# Altium project Main Project.PrjPcb
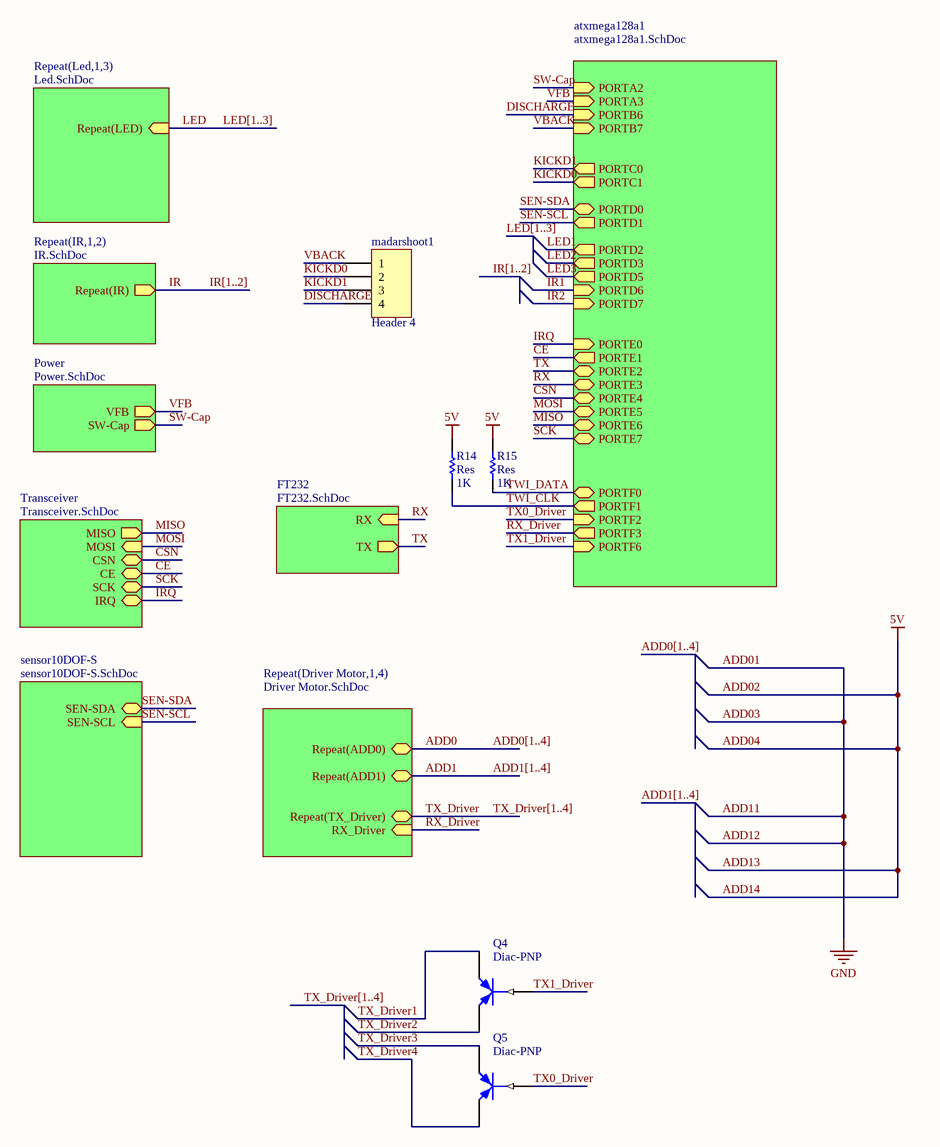
[diagram p0: Main Sheet.SchDoc]
9 sheets, 148 parts. Net scope: hierarchical (ports join the sheet entries above them; power ports are global).
Board file: PCB1.PcbDoc
Sheets:
  Main Sheet.SchDoc
    Led1 = Led.SchDoc
    Led2 = Led.SchDoc
    Led3 = Led.SchDoc
    IR1 = IR.SchDoc
    IR2 = IR.SchDoc
    atxmega128a1 = atxmega128a1.SchDoc
    Power = Power.SchDoc
    Transceiver = Transceiver.SchDoc
    Driver Motor1 = Driver Motor.SchDoc
    Driver Motor2 = Driver Motor.SchDoc
    Driver Motor3 = Driver Motor.SchDoc
    Driver Motor4 = Driver Motor.SchDoc
    FT232 = FT232.SchDoc
    sensor10DOF-S = sensor10DOF-S.SchDoc

## Sheet Main Sheet.SchDoc
size A3

### Parts
madarshoot1  Header 4  [sucket-smd-4pin]
Q4  Diac-PNP  [Diode-comcathod]
Q5  Diac-PNP  [Diode-comcathod]
R14  Res  value 1K  [2012[0805]]
R15  Res  value 1K  [2012[0805]]

### Sub-sheets
atxmega128a1 = atxmega128a1.SchDoc: PORTD5 (out), PORTD6 (in), PORTD7 (in), PORTD2 (out), PORTA3 (in), PORTE0 (in), PORTE1 (out), PORTE2, PORTB6 (in), PORTB7 (in), PORTC0 (out), PORTC1 (out), PORTF0 (bidir), PORTF1 (out), PORTE3, PORTE4, PORTE5, PORTE6, PORTE7, PORTA2 (in), PORTD3 (out), PORTD0, PORTD1 (out), PORTF2 (in), PORTF3 (out), PORTF6 (in)
FT232 = FT232.SchDoc: RX (in), TX (out)
Power = Power.SchDoc: VFB (out), SW-Cap (out)
Repeat(Driver Motor,1,4) = Driver Motor.SchDoc: Repeat(ADD0), Repeat(ADD1), Repeat(TX_Driver), RX_Driver (in)
Repeat(IR,1,2) = IR.SchDoc: Repeat(IR) (out)
Repeat(Led,1,3) = Led.SchDoc: Repeat(LED) (in)
sensor10DOF-S = sensor10DOF-S.SchDoc: SEN-SDA, SEN-SCL (in)
Transceiver = Transceiver.SchDoc: MISO (out), MOSI (in), CSN, CE, SCK, IRQ

### Nets
5V: R14.2 R15.2  [also labelled ADD02, ADD04, ADD13, ADD14]
ADD0: sheet Repeat(Driver Motor,1,4)/Repeat(ADD0)
ADD1: sheet Repeat(Driver Motor,1,4)/Repeat(ADD1)
CE: sheet atxmega128a1/PORTE1, sheet Transceiver/CE
CSN: sheet atxmega128a1/PORTE4, sheet Transceiver/CSN
DISCHARGE: madarshoot1.4 ; sheet atxmega128a1/PORTB6
IR: sheet Repeat(IR,1,2)/Repeat(IR)
IRQ: sheet atxmega128a1/PORTE0, sheet Transceiver/IRQ
KICKD0: madarshoot1.2 ; sheet atxmega128a1/PORTC1
KICKD1: madarshoot1.3 ; sheet atxmega128a1/PORTC0
LED: sheet Repeat(Led,1,3)/Repeat(LED)
MISO: sheet atxmega128a1/PORTE6, sheet Transceiver/MISO
MOSI: sheet atxmega128a1/PORTE5, sheet Transceiver/MOSI
RX: sheet atxmega128a1/PORTE3, sheet FT232/RX  [project net PORTE3]
RX_Driver: sheet atxmega128a1/PORTF3, sheet Repeat(Driver Motor,1,4)/RX_Driver  [project net PORTF3]
SCK: sheet atxmega128a1/PORTE7, sheet Transceiver/SCK  [project net PORTE7]
SEN-SCL: sheet atxmega128a1/PORTD1, sheet sensor10DOF-S/SEN-SCL  [project net PORTD1]
SEN-SDA: sheet atxmega128a1/PORTD0, sheet sensor10DOF-S/SEN-SDA  [project net PORTD0]
SW-Cap: sheet atxmega128a1/PORTA2, sheet Power/SW-Cap  [project net PORTA2]
TWI_CLK: R14.1 ; sheet atxmega128a1/PORTF1  [project net PORTF1]
TWI_DATA: R15.1 ; sheet atxmega128a1/PORTF0  [project net PORTF0]
TX: sheet atxmega128a1/PORTE2, sheet FT232/TX  [project net PORTE2]
TX0_Driver: Q5.1(B) ; sheet atxmega128a1/PORTF2  [project net PORTF2]
TX1_Driver: Q4.1(B) ; sheet atxmega128a1/PORTF6  [project net PORTF6]
TX_Driver: sheet Repeat(Driver Motor,1,4)/Repeat(TX_Driver)
TX_Driver1: Q4.3(C)  [project net TX_Driver]
TX_Driver2: Q4.2(E)  [project net TX_Driver]
TX_Driver3: Q5.3(C)  [project net TX_Driver]
TX_Driver4: Q5.2(E)  [project net TX_Driver]
VBACK: madarshoot1.1 ; sheet atxmega128a1/PORTB7  [project net PORTB7]
VFB: sheet atxmega128a1/PORTA3, sheet Power/VFB  [project net PORTA3]

### Buses and harness runs
bus ADD0[1..4]
bus ADD1[1..4]
bus IR[1..2]
bus LED[1..3]
bus TX_Driver[1..4]

### Notes on the sheet
- Title
- Size:
- Date:
- A3
- Number:
- Time:
- Revision:
- Sheet
- of
- File:

### Library data of the parts
madarshoot1 = Header 4: Header, 4-Pin; LatestRevisionDate: 17-Jul-2002; LatestRevisionNote: Re-released for DXP Platform.; Publisher: Altium Limited
Q4 Q5 = Diac-PNP: DIAC; Published: 24-Mar-1999; LatestRevisionDate: 29-May-2009; LatestRevisionNote: IPC-7351 Footprint Added.; PackageVersion: Jul-2004; PackageReference: SOT89; Publisher: Altium Limited; PackageDescription: 3-Pin SOT-89 Package 1.5 mm Pitch, 4.1 mm Lead Span; Code_JEDEC: TO-243-AA
R14 R15 = Res: Semiconductor Resistor; Published: 8-Jun-2000; LatestRevisionDate: 17-Jul-2002; LatestRevisionNote: Re-released for DXP Platform.; PackageReference: AXIAL-0.5; Publisher: Altium Limited

## Sheet Led.SchDoc
size A
Used 3 times, as channels Led1, Led2, Led3. Parts and nets are listed once, with the designators drawn on the sheet.
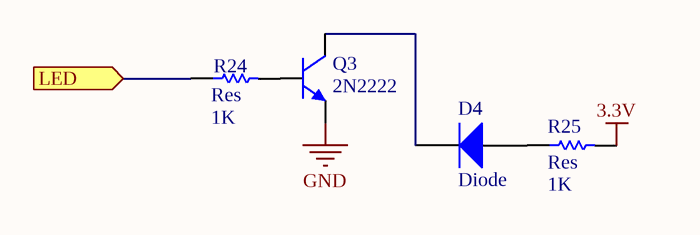
[diagram p1: Led.SchDoc]

### Parts
D4  Diode  [2012[0805]]
Q3  2N2222  [SOT-23]
R24  Res  value 1K  [2012[0805]]
R25  Res  value 1K  [2012[0805]]

### Ports
LED (in)

### Nets
3.3V: R25.2
GND: Q3.3(E)
LED: R24.1 ; port LED
NetD4_1: D4.1(A) R25.1
NetD4_2: D4.2(K) Q3.1(C)
NetQ3_2: Q3.2(B) R24.2

### Channels
Led1: designators end in _Led1; ports LED=LED1
Led2: designators end in _Led2; ports LED=LED2
Led3: designators end in _Led3; ports LED=LED3

### Library data of the parts
D4 = Diode: 1 Amp General Purpose Rectifier; Revision 1: 11-Jul-2000: SIM Model Added.; Revision 2: 17-Jul-2002: Re-released for DXP Platform.; Package Information: Latest Revision: Aug-1999; Code - JEDEC: DO-204-AL; Published: 8-Jun-2000; Datasheet: Latest Revision: 1998; Package Reference: DO-41; Publisher: Altium Limited
Q3 = 2N2222: NPN Bipolar Transistor; Published: 8-Jun-2000; LatestRevisionDate: 17-Jul-2002; LatestRevisionNote: Re-released for DXP Platform.; PackageReference: TO-226; Publisher: Altium Limited; Code_JEDEC: TO-226-AA
R24 R25 = Res: Semiconductor Resistor; Published: 8-Jun-2000; LatestRevisionDate: 17-Jul-2002; LatestRevisionNote: Re-released for DXP Platform.; PackageReference: AXIAL-0.5; Publisher: Altium Limited

## Sheet IR.SchDoc
size A
Used 2 times, as channels IR1, IR2. Parts and nets are listed once, with the designators drawn on the sheet.
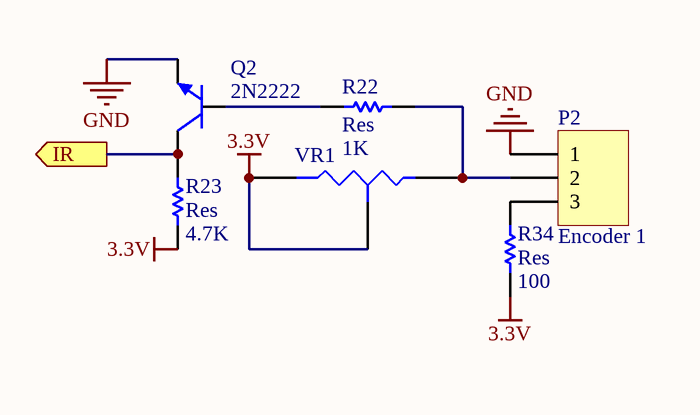
[diagram p2: IR.SchDoc]

### Parts
P2  Encoder 1  [HDR1X3]
Q2  2N2222  [SOT-23]
R22  Res  value 1K  [2012[0805]]
R23  Res  value 4.7K  [2012[0805]]
R34  Res  value 100  [2012[0805]]
VR1  Res Tap  [MULTITURN]  (value not drawn)

### Ports
IR (out)

### Nets
3.3V: R23.1 R34.1 VR1.2(B) VR1.3(TAP)
GND: P2.1 Q2.3(E)
IR: Q2.1(C) R23.2 ; port IR
NetP2_2: P2.2 R22.2 VR1.1(A)
NetP2_3: P2.3 R34.2
NetQ2_2: Q2.2(B) R22.1

### Channels
IR1: designators end in _IR1; ports IR=IR1
IR2: designators end in _IR2; ports IR=IR2

### Library data of the parts
P2 = Header 3: Header, 3-Pin; LatestRevisionDate: 17-Jul-2002; LatestRevisionNote: Re-released for DXP Platform.; Publisher: Altium Limited
Q2 = 2N2222: NPN Bipolar Transistor; Published: 8-Jun-2000; LatestRevisionDate: 17-Jul-2002; LatestRevisionNote: Re-released for DXP Platform.; PackageReference: TO-226; Publisher: Altium Limited; Code_JEDEC: TO-226-AA
R22 R23 R34 = Res: Semiconductor Resistor; Published: 8-Jun-2000; LatestRevisionDate: 17-Jul-2002; LatestRevisionNote: Re-released for DXP Platform.; PackageReference: AXIAL-0.5; Publisher: Altium Limited
VR1 = Res Tap: Tapped Resistor; Sim Note: Enter the Resistance value and the set point into parameter fields.; Set Position: 0.5; Published: 24-Mar-1999; LatestRevisionDate: 17-Jul-2002; LatestRevisionNote: Re-released for DXP Platform.; PackageReference: VR3; Publisher: Altium Limited

## Sheet atxmega128a1.SchDoc
size A3
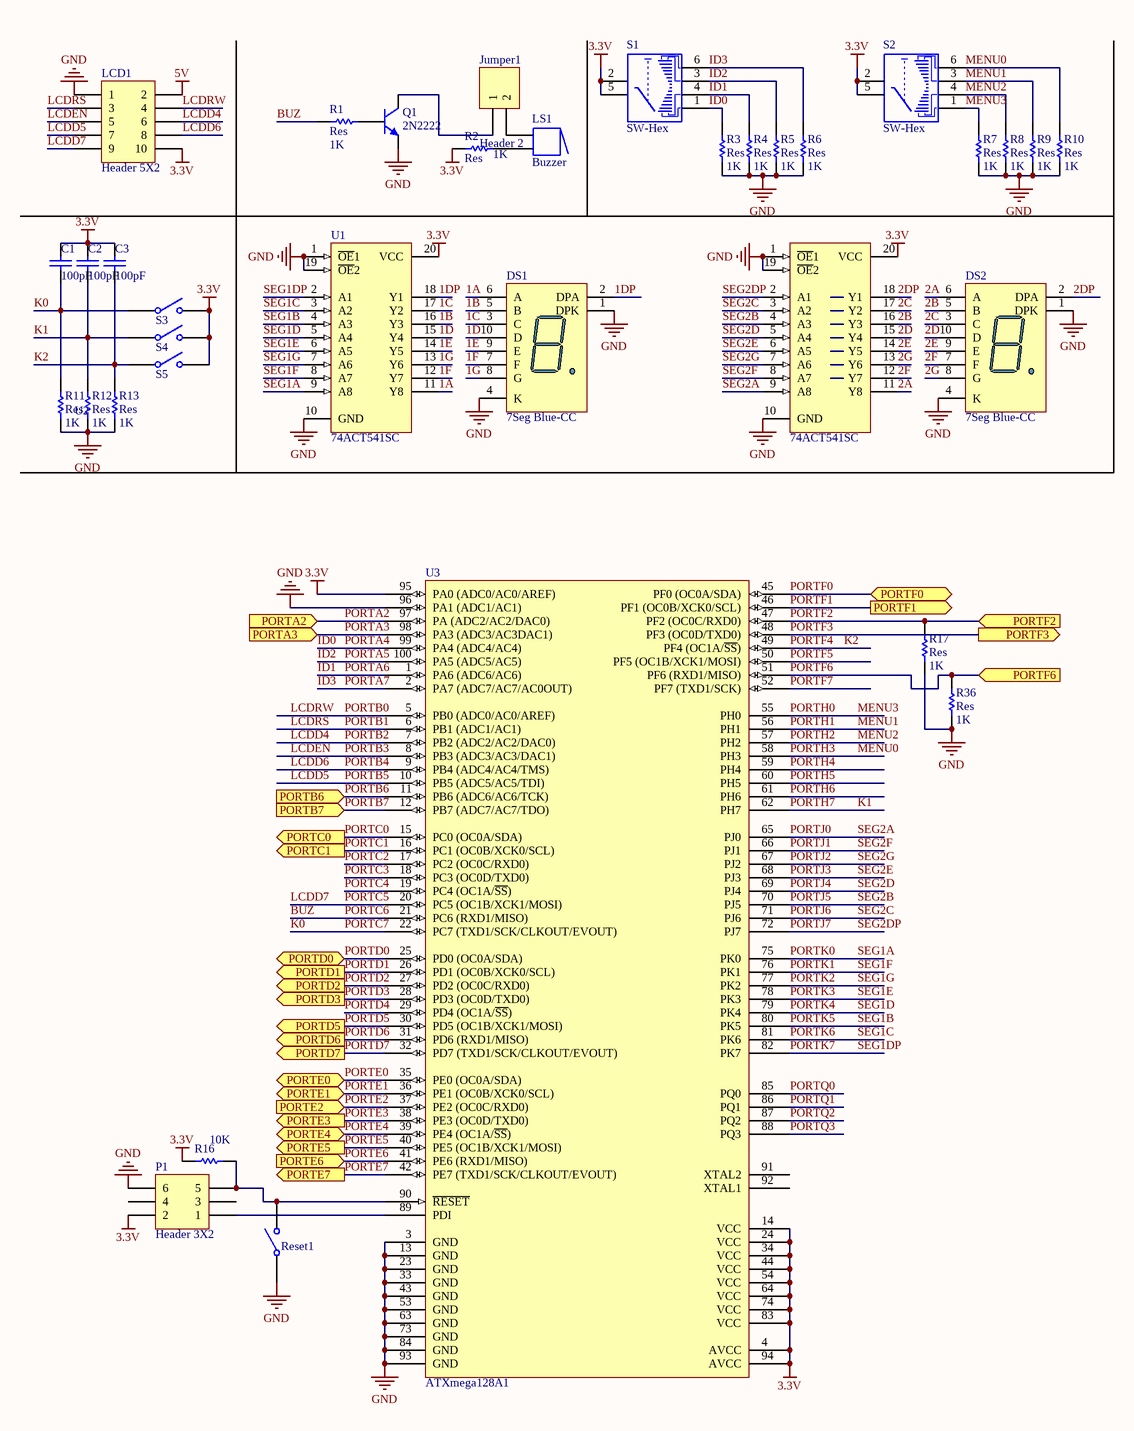
[diagram p3: atxmega128a1.SchDoc]

### Parts
C1  value 100pF  [2012[0805]]  (hidden comment: Cap_UP)
C2  value 100pF  [2012[0805]]  (hidden comment: Cap_UP)
C3  value 100pF  [2012[0805]]  (hidden comment: Cap_UP)
DS1  7Seg Blue-CC  [7Segment Small]
DS2  7Seg Blue-CC  [7Segment Small]
Jumper1  Header 2  [HDR1X2]
LCD1  Header 5X2  [HDRBOX2X5]
LS1  Buzzer  [BUZZER]
P1  Header 3X2  [HDRBOX2X3]
Q1  2N2222  [SOT-23]
R1  Res  value 1K  [2012[0805]]
R2  Res  value 1K  [2012[0805]]
R3  Res  value 1K  [2012[0805]]
R4  Res  value 1K  [2012[0805]]
R5  Res  value 1K  [2012[0805]]
R6  Res  value 1K  [2012[0805]]
R7  Res  value 1K  [2012[0805]]
R8  Res  value 1K  [2012[0805]]
R9  Res  value 1K  [2012[0805]]
R10  Res  value 1K  [2012[0805]]
R11  Res  value 1K  [2012[0805]]
R12  Res  value 1K  [2012[0805]]
R13  Res  value 1K  [2012[0805]]
R16  10K  [2012[0805]]
R17  Res  value 1K  [2012[0805]]
R36  Res  value 1K  [2012[0805]]
Reset1  SW-SPST  [PUSH-BUT]  (value not drawn)
S1  SW-Hex  [SW-HEX]
S2  SW-Hex  [SW-HEX]
S3  SW-SPST  [PUSH-BUT]  (value not drawn)
S4  SW-SPST  [PUSH-BUT]  (value not drawn)
S5  SW-SPST  [PUSH-BUT]  (value not drawn)
U1  74ACT541SC  [M20B_M]
U2  74ACT541SC  [M20B_M]
U3  ATXmega128A1  [100A_N]

### Ports
PORTA2 (in), PORTA3 (in), PORTB6 (in), PORTB7 (in), PORTC0 (out), PORTC1 (out), PORTD0, PORTD1 (out), PORTD2 (out), PORTD3 (out), PORTD5 (out), PORTD6 (out), PORTD7 (out), PORTE0, PORTE1, PORTE2 (in), PORTE3 (out), PORTE4, PORTE5 (out), PORTE6 (in), PORTE7 (out), PORTF0, PORTF1 (out), PORTF2 (in), PORTF3 (out), PORTF6 (in)

### Nets
3.3V: C1.2 C2.2 C3.2 LCD1.10 P1.2 R2.1 R16.1 S1.2 S1.5 S2.2 S2.5 S3.2(NO) S4.2(NO) S5.2(NO) U1.20(VCC) U2.20(VCC) U3.4(AVCC) U3.14(VCC) U3.24(VCC) U3.34(VCC) U3.44(VCC) U3.54(VCC) U3.64(VCC) U3.74(VCC) U3.83(VCC) U3.94(AVCC) U3.95(PA0_(ADC0/AC0/AREF))
5V: LCD1.2
GND: DS1.1(DPK) DS1.4(K) DS2.1(DPK) DS2.4(K) LCD1.1 P1.6 Q1.3(E) R3.1 R4.1 R5.1 R6.1 R7.1 R8.1 R9.1 R10.1 R11.2 R12.2 R13.2 R17.1 R36.1 Reset1.1(COMMON) U1.1(~{OE}1) U1.10(GND) U1.19(~{OE}2) U2.1(~{OE}1) U2.10(GND) U2.19(~{OE}2) U3.3(GND) U3.13(GND) U3.23(GND) U3.33(GND) U3.43(GND) U3.53(GND) U3.63(GND) U3.73(GND) U3.84(GND) U3.93(GND) U3.96(PA1_(ADC1/AC1))  [project net ADD0]
1A: DS1.6(A) U1.11(Y8)
1B: DS1.5(B) U1.16(Y3)
1C: DS1.3(C) U1.17(Y2)
1D: DS1.10(D) U1.15(Y4)
1DP: DS1.2(DPA) U1.18(Y1)
1E: DS1.9(E) U1.14(Y5)
1F: DS1.7(F) U1.12(Y7)
1G: DS1.8(G) U1.13(Y6)
2A: DS2.6(A) U2.11(Y8)
2B: DS2.5(B) U2.16(Y3)
2C: DS2.3(C) U2.17(Y2)
2D: DS2.10(D) U2.15(Y4)
2DP: DS2.2(DPA) U2.18(Y1)
2E: DS2.9(E) U2.14(Y5)
2F: DS2.7(F) U2.12(Y7)
2G: DS2.8(G) U2.13(Y6)
BUZ: R1.1 U3.21(PC6_(RXD1/MISO))  [also labelled PORTC6]
ID0: R3.2 S1.1 U3.99(PA4_(ADC4/AC4))  [also labelled PORTA4]
ID1: R4.2 S1.4 U3.1(PA6_(ADC6/AC6))  [also labelled PORTA6]
ID2: R5.2 S1.3 U3.100(PA5_(ADC5/AC5))  [also labelled PORTA5]
ID3: R6.2 S1.6 U3.2(PA7_(ADC7/AC7/AC0OUT))  [also labelled PORTA7]
K0: C1.1 R11.1 S3.1(COMMON) U3.22(PC7_(TXD1/SCK/CLKOUT/EVOUT))  [also labelled PORTC7]
K1: C2.1 R12.1 S4.1(COMMON) U3.62(PH7)  [also labelled PORTH7]
K2: C3.1 R13.1 S5.1(COMMON) U3.49(PF4_(OC1A/~{SS}))  [also labelled PORTF4]
LCDD4: LCD1.6 U3.7(PB2_(ADC2/AC2/DAC0))  [also labelled PORTB2]
LCDD5: LCD1.7 U3.10(PB5_(ADC5/AC5/TDI))  [also labelled PORTB5]
LCDD6: LCD1.8 U3.9(PB4_(ADC4/AC4/TMS))  [also labelled PORTB4]
LCDD7: LCD1.9 U3.20(PC5_(OC1B/XCK1/MOSI))  [also labelled PORTC5]
LCDEN: LCD1.5 U3.8(PB3_(ADC3/AC3/DAC1))  [also labelled PORTB3]
LCDRS: LCD1.3 U3.6(PB1_(ADC1/AC1))  [also labelled PORTB1]
LCDRW: LCD1.4 U3.5(PB0_(ADC0/AC0/AREF))  [also labelled PORTB0]
MENU0: R10.2 S2.6 U3.58(PH3)  [also labelled PORTH3]
MENU1: R9.2 S2.3 U3.56(PH1)  [also labelled PORTH1]
MENU2: R8.2 S2.4 U3.57(PH2)  [also labelled PORTH2]
MENU3: R7.2 S2.1 U3.55(PH0)  [also labelled PORTH0]
PORTA2: U3.97(PA_(ADC2/AC2/DAC0)) ; port PORTA2
PORTA3: U3.98(PA3_(ADC3/AC3DAC1)) ; port PORTA3
PORTB6: U3.11(PB6_(ADC6/AC6/TCK)) ; port PORTB6  [project net DISCHARGE]
PORTB7: U3.12(PB7_(ADC7/AC7/TDO)) ; port PORTB7
PORTC0: U3.15(PC0_(OC0A/SDA)) ; port PORTC0  [project net KICKD1]
PORTC1: U3.16(PC1_(OC0B/XCK0/SCL)) ; port PORTC1  [project net KICKD0]
PORTC2: U3.17(PC2_(OC0C/RXD0))
PORTC3: U3.18(PC3_(OC0D/TXD0))
PORTC4: U3.19(PC4_(OC1A/~{SS}))
PORTD0: U3.25(PD0_(OC0A/SDA)) ; port PORTD0
PORTD1: U3.26(PD1_(OC0B/XCK0/SCL)) ; port PORTD1
PORTD2: U3.27(PD2_(OC0C/RXD0)) ; port PORTD2  [project net LED1]
PORTD3: U3.28(PD3_(OC0D/TXD0)) ; port PORTD3  [project net LED2]
PORTD4: U3.29(PD4_(OC1A/~{SS}))
PORTD5: U3.30(PD5_(OC1B/XCK1/MOSI)) ; port PORTD5  [project net LED3]
PORTD6: U3.31(PD6_(RXD1/MISO)) ; port PORTD6  [project net IR1]
PORTD7: U3.32(PD7_(TXD1/SCK/CLKOUT/EVOUT)) ; port PORTD7  [project net IR2]
PORTE0: U3.35(PE0_(OC0A/SDA)) ; port PORTE0  [project net IRQ]
PORTE1: U3.36(PE1_(OC0B/XCK0/SCL)) ; port PORTE1  [project net CE]
PORTE2: U3.37(PE2_(OC0C/RXD0)) ; port PORTE2
PORTE3: U3.38(PE3_(OC0D/TXD0)) ; port PORTE3
PORTE4: U3.39(PE4_(OC1A/~{SS})) ; port PORTE4  [project net CSN]
PORTE5: U3.40(PE5_(OC1B/XCK1/MOSI)) ; port PORTE5  [project net MOSI]
PORTE6: U3.41(PE6_(RXD1/MISO)) ; port PORTE6  [project net MISO]
PORTE7: U3.42(PE7_(TXD1/SCK/CLKOUT/EVOUT)) ; port PORTE7
PORTF0: U3.45(PF0_(OC0A/SDA)) ; port PORTF0
PORTF1: U3.46(PF1_(OC0B/XCK0/SCL)) ; port PORTF1
PORTF2: R17.2 U3.47(PF2_(OC0C/RXD0)) ; port PORTF2
PORTF3: U3.48(PF3_(OC0D/TXD0)) ; port PORTF3
PORTF5: U3.50(PF5_(OC1B/XCK1/MOSI))
PORTF6: R36.2 U3.51(PF6_(RXD1/MISO)) ; port PORTF6
PORTF7: U3.52(PF7_(TXD1/SCK))
PORTH4: U3.59(PH4)
PORTH5: U3.60(PH5)
PORTH6: U3.61(PH6)
PORTJ0: U2.9(A8) U3.65(PJ0)  [also labelled SEG2A]
PORTJ1: U2.8(A7) U3.66(PJ1)  [also labelled SEG2F]
PORTJ2: U2.7(A6) U3.67(PJ2)  [also labelled SEG2G]
PORTJ3: U2.6(A5) U3.68(PJ3)  [also labelled SEG2E]
PORTJ4: U2.5(A4) U3.69(PJ4)  [also labelled SEG2D]
PORTJ5: U2.4(A3) U3.70(PJ5)  [also labelled SEG2B]
PORTJ6: U2.3(A2) U3.71(PJ6)  [also labelled SEG2C]
PORTJ7: U2.2(A1) U3.72(PJ7)  [also labelled SEG2DP]
PORTK0: U1.9(A8) U3.75(PK0)  [also labelled SEG1A]
PORTK1: U1.8(A7) U3.76(PK1)  [also labelled SEG1F]
PORTK2: U1.7(A6) U3.77(PK2)  [also labelled SEG1G]
PORTK3: U1.6(A5) U3.78(PK3)  [also labelled SEG1E]
PORTK4: U1.5(A4) U3.79(PK4)  [also labelled SEG1D]
PORTK5: U1.4(A3) U3.80(PK5)  [also labelled SEG1B]
PORTK6: U1.3(A2) U3.81(PK6)  [also labelled SEG1C]
PORTK7: U1.2(A1) U3.82(PK7)  [also labelled SEG1DP]
PORTQ0: U3.85(PQ0)
PORTQ1: U3.86(PQ1)
PORTQ2: U3.87(PQ2)
PORTQ3: U3.88(PQ3)
NetJumper1_1: Jumper1.1 Q1.1(C)
NetJumper1_2: Jumper1.2 LS1.1
NetLS1_2: LS1.2 R2.2
NetP1_1: P1.1 U3.89(PDI)
NetP1_5: P1.5 R16.2 Reset1.2(NO) U3.90(~{RESET})
NetQ1_2: Q1.2(B) R1.2

Not connected (* = marked no-connect by the designer): P1 3 4; U3 91(XTAL2) 92(XTAL1)

### Library data of the parts
C1-C3 = Cap_UP: Capacitor; Published: 8-Jun-2000; LatestRevisionDate: 17-Jul-2002; LatestRevisionNote: Re-released for DXP Platform.; PackageReference: RAD-0.3; Publisher: Altium Limited
DS1 DS2 = 7Seg Blue-CC_1: 14.2 mm General Purpose Blue 7-Segment Display: CC, RH DP, Gray Surface; MinimumIntensity: 2020 ucd; Note: IF = 10 mA; Published: 8-Jun-2000; LatestRevisionDate: 17-Dec-2003; LatestRevisionNote: Schematic revised, PCB Footprint replaced.; DatasheetDocument: 24-Sep-2002; PackageDocument: 24-Sep-2002; PackageReference: H; Publisher: Altium Limited; Colour: Blue; ComponentLink1Description: Manufacturer Link; ComponentLink1URL: http://www.agilent.com/
Jumper1 = Header 2: Header, 2-Pin; LatestRevisionDate: 17-Jul-2002; LatestRevisionNote: Re-released for DXP Platform.; Publisher: Altium Limited
LCD1 = Header 5X2: Header, 5-Pin, Dual row; LatestRevisionDate: 17-Jul-2002; LatestRevisionNote: Re-released for DXP Platform.; Publisher: Altium Limited
LS1 = Buzzer: Magnetic Transducer Buzzer; Published: 24-Mar-1999; LatestRevisionDate: 17-Dec-2003; LatestRevisionNote: Schematic revised, PCB Footprint replaced.; DatasheetDocument: 17-Dec-2003; PackageReference: ABSM-1574; Publisher: Altium Limited; ComponentLink1Description: Manufacturer Link; ComponentLink1URL: http://www.megastar.com/linecard/buzzmode/index.php
P1 = Header 3X2: Header, 3-Pin, Dual row; LatestRevisionDate: 17-Jul-2002; LatestRevisionNote: Re-released for DXP Platform.; Publisher: Altium Limited
Q1 = 2N2222: NPN Bipolar Transistor; Published: 8-Jun-2000; LatestRevisionDate: 17-Jul-2002; LatestRevisionNote: Re-released for DXP Platform.; PackageReference: TO-226; Publisher: Altium Limited; Code_JEDEC: TO-226-AA
R1-R13 R16 R17 R36 = Res: Semiconductor Resistor; Published: 8-Jun-2000; LatestRevisionDate: 17-Jul-2002; LatestRevisionNote: Re-released for DXP Platform.; PackageReference: AXIAL-0.5; Publisher: Altium Limited
Reset1 S3-S5 = SW-SPST: Single-Pole, Single-Throw Switch; Published: 24-Mar-1999; Revision: July-2002: Re-released for DXP Platform.; Publisher: Altium Limited
U1 U2 = 74ACT541SC: Octal Buffer/Line Driver with 3-State Output; Published: 17-Jul-2002; LatestRevisionDate: 13-Apr-2006; LatestRevisionNote: IPC-7351 Footprint Added.; DatasheetVersion: Oct-1999; PackageVersion: 2000; PackageReference: M20B; Publisher: Altium Limited; PackageDescription: 20-Pin Small Outline Integrated Circuit 1.27 mm Pitch; Code_JEDEC: MS-013-AC; Code_IPC: SOIC127P1030-20; ComponentLink1Description: Manufacturer Link; ComponentLink1URL: http://www.fairchildsemi.com/; ComponentLink2Description: Datasheet; ComponentLink2URL: http://www.fairchildsemi.com/ds/74%2F74AC541.pdf
S1 S2 = SW-Hex: Published: 24-Mar-1999; LatestRevisionDate: 17-Jul-2002; LatestRevisionNote: Re-released for DXP Platform.; PackageReference: DIP-8; Publisher: Altium Limited

## Sheet Power.SchDoc
size A
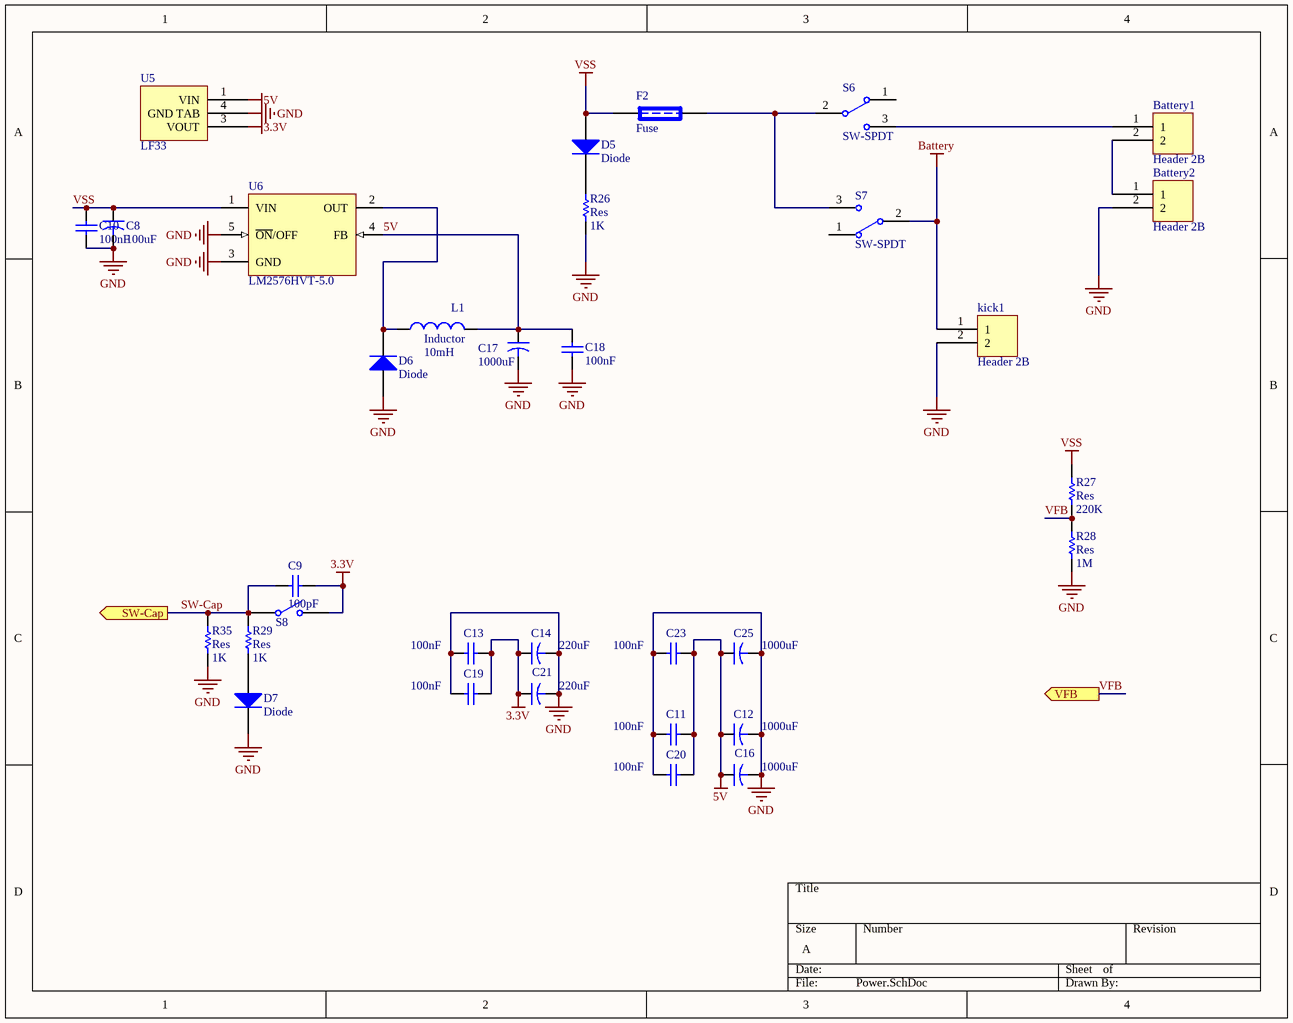
[diagram p4: Power.SchDoc]

### Parts
Battery1  Header 2B  [BHDR1X2]
Battery2  Header 2B  [BHDR1X2]
C8  value 100uF  [Cap1000u-16]  (hidden comment: Cap_El)
C9  value 100pF  [2012[0805]]  (hidden comment: Cap_UP)
C10  value 100nF  [2012[0805]]  (hidden comment: Cap_UP)
C11  value 100nF  [2012[0805]]  (hidden comment: Cap_UP)
C12  value 1000uF  [7343]  (hidden comment: Cap_El)
C13  value 100nF  [2012[0805]]  (hidden comment: Cap_UP)
C14  value 220uF  [7343]  (hidden comment: Cap_El)
C16  value 1000uF  [7343]  (hidden comment: Cap_El)
C17  value 1000uF  [7343]  (hidden comment: Cap_El)
C18  value 100nF  [2012[0805]]  (hidden comment: Cap_UP)
C19  value 100nF  [2012[0805]]  (hidden comment: Cap_UP)
C20  value 100nF  [2012[0805]]  (hidden comment: Cap_UP)
C21  value 220uF  [7343]  (hidden comment: Cap_El)
C23  value 100nF  [2012[0805]]  (hidden comment: Cap_UP)
C25  value 1000uF  [7343]  (hidden comment: Cap_El)
D5  Diode  [2012[0805]]
D6  Diode  [US1M]
D7  Diode  [2012[0805]]
F2  Fuse  [fuse kh]
kick1  Header 2B  [BHDR1X2]
L1  Inductor  value 10mH  [inductor]
R26  Res  value 1K  [2012[0805]]
R27  Res  value 220K  [2012[0805]]
R28  Res  value 1M  [2012[0805]]
R29  Res  value 1K  [2012[0805]]
R35  Res  value 1K  [2012[0805]]
S6  SW-SPDT  [KEYKHRAB]
S7  SW-SPDT  [KEYKHRAB]
S8  SW-SPST  [push button B]  (value not drawn)
U5  LF33  [D-PACK]
U6  LM2576HVT-5.0  [T05A]

### Ports
SW-Cap (out), VFB (out)

### Nets
3.3V: C9.2 C13.2 C14.1 C19.2 C21.1 S8.2(NO) U5.3(VOUT)
5V: C11.2 C12.1 C16.1 C17.1 C18.2 C20.2 C23.2 C25.1 L1.2 U5.1(VIN) U6.4(FB)
Battery: kick1.1 S7.2
GND: Battery2.2 C8.2 C10.1 C11.1 C12.2 C13.1 C14.2 C16.2 C17.2 C18.1 C19.1 C20.1 C21.2 C23.1 C25.2 D6.1(A) D7.2(K) kick1.2 R26.1 R28.1 R35.1 U5.4(GND_TAB) U6.3(GND) U6.5(~{ON}/OFF)  [project net ADD0]
VSS: C8.1 C10.2 D5.1(A) F2.1 R27.2 U6.1(VIN)
SW-Cap: C9.1 R29.2 R35.2 S8.1(COMMON) ; port SW-Cap  [project net PORTA2]
VFB: R27.1 R28.2 ; port VFB  [project net PORTA3]
NetBattery1_1: Battery1.1 S6.3
NetBattery1_2: Battery1.2 Battery2.1
NetD5_2: D5.2(K) R26.2
NetD6_2: D6.2(K) L1.1 U6.2(OUT)
NetD7_1: D7.1(A) R29.1
NetF2_2: F2.2 S6.2 S7.3

Not connected (* = marked no-connect by the designer): S6 1(3); S7 1(3)

### Library data of the parts
C8 C12 C14 C16 C17 C21 C25 = Cap_El: Capacitor; Published: 23-Sep-2002; PackageReference: CAPR5-4X5; Publisher: Altium Limited
C9-C11 C13 C18-C20 C23 = Cap_UP: Capacitor; Published: 8-Jun-2000; LatestRevisionDate: 17-Jul-2002; LatestRevisionNote: Re-released for DXP Platform.; PackageReference: RAD-0.3; Publisher: Altium Limited
D5-D7 = Diode: as D4 on sheet Led; Published: 8-Jun-2000; Datasheet: Latest Revision: 1998; Package Reference: DO-41; Publisher: Altium Limited
L1 = Inductor: Code_IEC: 1005; Published: 8-Jun-2000; LatestRevisionDate: 17-Jul-2002; LatestRevisionNote: Re-released for DXP Platform.; PackageReference: 0402-A; Publisher: Altium Limited; Code_JEITA: 0402
R26-R29 R35 = Res: Semiconductor Resistor; Published: 8-Jun-2000; LatestRevisionDate: 17-Jul-2002; LatestRevisionNote: Re-released for DXP Platform.; PackageReference: AXIAL-0.5; Publisher: Altium Limited
S6 S7 = SW-SPDT: SPDT Subminiature Toggle Switch, Right Angle Mounting, Vertical Actuation; Published: 24-Mar-1999; LatestRevisionDate: 17-Dec-2003; LatestRevisionNote: Schematic revised, PCB Footprint replaced.; DatasheetDocument: 05-Dec-2000; PackageReference: TL36WW15050; Publisher: Altium Limited; ComponentLink1Description: Manufacturer Link; ComponentLink1URL: http://www.apem.com
S8 = SW-SPST: Single-Pole, Single-Throw Switch; Published: 24-Mar-1999; Revision: July-2002: Re-released for DXP Platform.; Publisher: Altium Limited
U5 = 7805
U6 = LM2576HVT-5.0: SIMPLE SWITCHER; 3A Step-Down Voltage Regulator; Manufacturer: National Semiconductor; PackageTopMarking: NSUZXYTT*LM2576HVT*-5.0 P+; Published: 27-Nov-2008; DatasheetVersion: Aug-2004; PackageVersion: revJ, Jan-1992; PackageReference: T05A; Publisher: Altium Limited; PackageDescription: TO-220, Molded, 5 Lead, Straight; CompType: Switcher; PartNumber: LM2576HVT-5.0; RoHS: O; PinCount: 5; DigiKeyPartNumber: LM2576HVT-5.0-ND; Code_JEDEC: TO-220-AB; ComponentLink1Description: LM2576HV Datasheet; ComponentLink1URL: http://www.national.com/ds/LM/LM2576HV.pdf; ComponentLink2Description: LM2576HV Web Page; ComponentLink2URL: http://www.national.com/pf/LM/LM2576HV.html; ComponentLink3Description: T05A Package Page; ComponentLink3URL: http://www.national.com/packaging/folders/t05a.html
F2 = Fuse: Published: 8-Jun-2000; LatestRevisionDate: 17-Jul-2002; LatestRevisionNote: Re-released for DXP Platform.; PackageReference: PIN-W2/E2.8; Publisher: Altium Limited

## Sheet Transceiver.SchDoc
size A
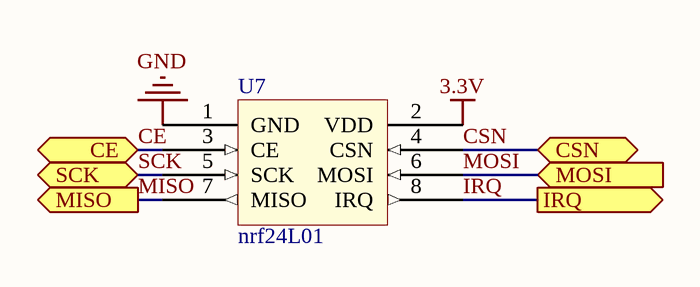
[diagram p5: Transceiver.SchDoc]

### Parts
U7  nrf24L01  [NRF24L01]

### Ports
CE, CSN, IRQ (out), MISO (out), MOSI (in), SCK

### Nets
3.3V: U7.2(VDD)
GND: U7.1(GND)  [project net ADD0]
CE: U7.3(CE) ; port CE
CSN: U7.4(CSN) ; port CSN
IRQ: U7.8(IRQ) ; port IRQ
MISO: U7.7(MISO) ; port MISO
MOSI: U7.6(MOSI) ; port MOSI
SCK: U7.5(SCK) ; port SCK  [project net PORTE7]

## Sheet Driver Motor.SchDoc
size A
Used 4 times, as channels Driver Motor1, Driver Motor2, Driver Motor3, Driver Motor4. Parts and nets are listed once, with the designators drawn on the sheet.
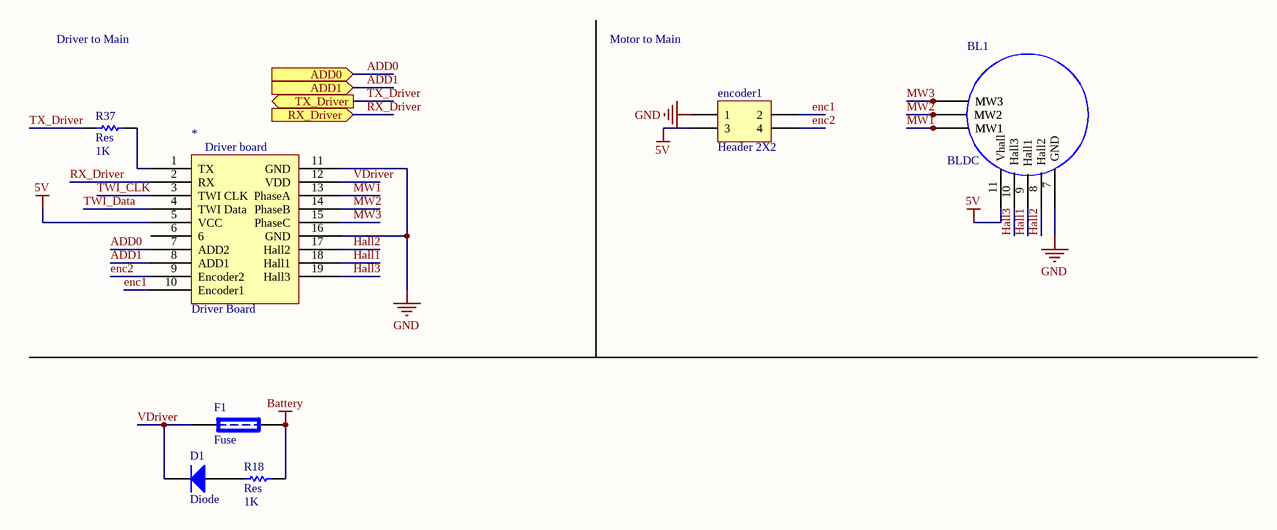
[diagram p6: Driver Motor.SchDoc]

### Parts
*  Driver Board  [Driver board]
BL1  BLDC  [FLT11]
D1  Diode  [2012[0805]]
encoder1  Header 2X2  [encoder 4pin]
F1  Fuse  [fuse kh]
R18  Res  value 1K  [2012[0805]]
R37  Res  value 1K  [2012[0805]]

### Ports
ADD0 (in), ADD1 (in), RX_Driver (in), TX_Driver (out)

### Nets
5V: *.5(VCC) BL1.11(Vhall) encoder1.3
Battery: F1.2 R18.1
GND: *.11(GND) *.16(GND) BL1.7(GND) encoder1.1
ADD0: *.7(ADD2) ; port ADD0
ADD1: *.8(ADD1) ; port ADD1
enc1: *.10(Encoder1) encoder1.2
enc2: *.9(Encoder2) encoder1.4
Hall1: *.18(Hall1) BL1.9(Hall1)
Hall2: *.17(Hall2) BL1.8(Hall2)
Hall3: *.19(Hall3) BL1.10(Hall3)
MW1: *.13(PhaseA) BL1.1(MW1) BL1.2(MW1)
MW2: *.14(PhaseB) BL1.3(MW2) BL1.4(MW2)
MW3: *.15(PhaseC) BL1.5(MW3) BL1.6(MW3)
RX_Driver: *.2(RX) ; port RX_Driver
TWI_CLK: *.3(TWI_CLK)
TWI_Data: *.4(TWI_Data)
TX_Driver: R37.2 ; port TX_Driver
VDriver: *.12(VDD) D1.2(K) F1.1
Net*_1: *.1(TX) R37.1
NetD1_1: D1.1(A) R18.2

Not connected (* = marked no-connect by the designer): * 6

### Channels
Driver Motor1: designators *=*_Driver_Motor1 BL1=BL1_DriverMotor1 D1=D1_DriverMotor1 encoder1=encoder1_DriverMotor1 F1=F1_DriverMotor1 R18=R18_DriverMotor1 R37=R37_DriverMotor1; ports ADD0=ADD0 ADD1=ADD0 RX_Driver=PORTF3 TX_Driver=TX_Driver
Driver Motor2: designators *=*_Driver_Motor2 BL1=BL1_DriverMotor2 D1=D1_DriverMotor2 encoder1=encoder1_DriverMotor2 F1=F1_DriverMotor2 R18=R18_DriverMotor2 R37=R37_DriverMotor2; ports ADD0=5V ADD1=ADD0 RX_Driver=PORTF3 TX_Driver=TX_Driver
Driver Motor3: designators *=*_Driver_Motor3 BL1=BL1_DriverMotor3 D1=D1_DriverMotor3 encoder1=encoder1_DriverMotor3 F1=F1_DriverMotor3 R18=R18_DriverMotor3 R37=R37_DriverMotor3; ports ADD0=ADD0 ADD1=5V RX_Driver=PORTF3 TX_Driver=TX_Driver
Driver Motor4: designators *=*_Driver_Motor4 BL1=BL1_DriverMotor4 D1=D1_DriverMotor4 encoder1=encoder1_DriverMotor4 F1=F1_DriverMotor4 R18=R18_DriverMotor4 R37=R37_DriverMotor4; ports ADD0=5V ADD1=5V RX_Driver=PORTF3 TX_Driver=TX_Driver

### Notes on the sheet
- Driver to Main
- Motor to Main
- (in symbol Driver Board) Driver board

### Library data of the parts
D1 = Diode: as D4 on sheet Led; Published: 8-Jun-2000; Datasheet: Latest Revision: 1998; Package Reference: DO-41; Publisher: Altium Limited
encoder1 = Header 2X2: Header, 2-Pin, Dual row; LatestRevisionDate: 17-Jul-2002; LatestRevisionNote: Re-released for DXP Platform.; Publisher: Altium Limited
R18 R37 = Res: Semiconductor Resistor; Published: 8-Jun-2000; LatestRevisionDate: 17-Jul-2002; LatestRevisionNote: Re-released for DXP Platform.; PackageReference: AXIAL-0.5; Publisher: Altium Limited
F1 = Fuse: Published: 8-Jun-2000; LatestRevisionDate: 17-Jul-2002; LatestRevisionNote: Re-released for DXP Platform.; PackageReference: PIN-W2/E2.8; Publisher: Altium Limited

## Sheet FT232.SchDoc
size A4
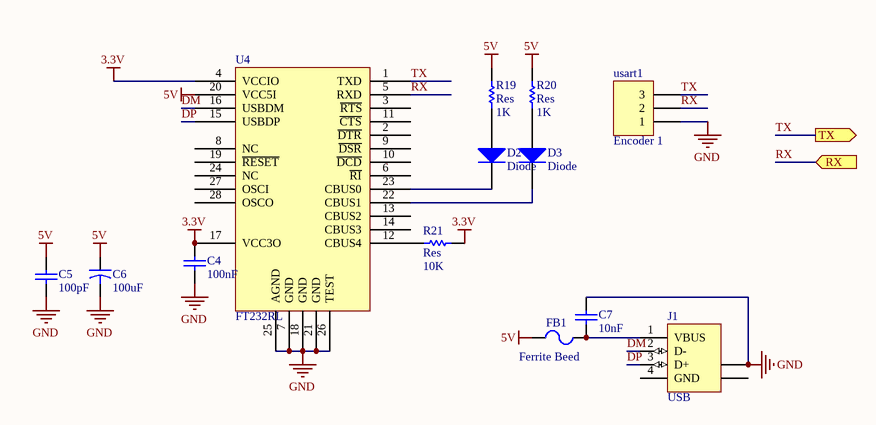
[diagram p7: FT232.SchDoc]

### Parts
C4  value 100nF  [2012[0805]]  (hidden comment: Cap_UP)
C5  value 100pF  [2012[0805]]  (hidden comment: Cap_UP)
C6  value 100uF  [7343]  (hidden comment: Cap_El)
C7  value 10nF  [2012[0805]]  (hidden comment: Cap_UP)
D2  Diode  [2012[0805]]
D3  Diode  [2012[0805]]
FB1  Ferrite Beed  [2012[0805]]
J1  USB  [USB_MINI]
R19  Res  value 1K  [2012[0805]]
R20  Res  value 1K  [2012[0805]]
R21  Res  value 10K  [2012[0805]]
U4  FT232RL  [SSOP28]
usart1  Encoder 1  [HDR1X3]

### Ports
RX (in), TX (out)

### Nets
3.3V: C4.2 R21.2 U4.4(VCCIO) U4.17(VCC3O)
5V: C5.2 C6.1 FB1.1 R19.2 R20.2 U4.20(VCC5I)
GND: C4.1 C5.1 C6.2 C7.1 J1.5(SHLD) U4.7(GND) U4.18(GND) U4.21(GND) U4.25(AGND) U4.26(TEST) usart1.1  [project net ADD0]
DM: J1.2(D-) U4.16(USBDM)
DP: J1.3(D+) U4.15(USBDP)
RX: U4.5(RXD) usart1.2 ; port RX  [project net PORTE3]
TX: U4.1(TXD) usart1.3 ; port TX  [project net PORTE2]
NetC7_2: C7.2 FB1.2 J1.1(VBUS)
NetD2_1: D2.1(A) R19.1
NetD2_2: D2.2(K) U4.23(CBUS0)
NetD3_1: D3.1(A) R20.1
NetD3_2: D3.2(K) U4.22(CBUS1)
NetR21_1: R21.1 U4.12(CBUS4)

Not connected (* = marked no-connect by the designer): J1 4(GND) 6(SHLD); U4 2(~{DTR}) 3(~{RTS}) 6(~{RI}) 8(NC) 9(~{DSR}) 10(~{DCD}) 11(~{CTS}) 13(CBUS2) 14(CBUS3) 19(~{RESET}) 24(NC) 27(OSCI) 28(OSCO)

### Library data of the parts
C4 C5 C7 = Cap_UP: Capacitor; Published: 8-Jun-2000; LatestRevisionDate: 17-Jul-2002; LatestRevisionNote: Re-released for DXP Platform.; PackageReference: RAD-0.3; Publisher: Altium Limited
C6 = Cap_El: Capacitor; Published: 23-Sep-2002; PackageReference: CAPR5-4X5; Publisher: Altium Limited
D2 D3 = Diode: as D4 on sheet Led; Published: 8-Jun-2000; Datasheet: Latest Revision: 1998; Package Reference: DO-41; Publisher: Altium Limited
FB1 = Ferrite Beed: Code_IEC: 1005; Published: 8-Jun-2000; LatestRevisionDate: 17-Jul-2002; LatestRevisionNote: Re-released for DXP Platform.; PackageReference: 0402-A; Publisher: Altium Limited; Code_JEITA: 0402
J1 = USB: USB 1.1, Right Angle, Thru-Hole, A Type, Receptacle, 4 Position, Black; ContactMaterial: Copper Alloy; ContactPlating: Gold (30) over Palladium Nickel; TerminationLength: 2.84mm [0.112in.]; PCB_Layout: Complies with manufacturer's recommendation.; DrillSize: Corresponds to nominal value.; PanelGround: Without; Published: 15-Jul-2004; DatasheetDocument: 11-Jan-2004; PackageDocument: 11-Jan-2004; PackageReference: 1364372; Publisher: Altium Limited; HousingMaterial: Thermoplastic; ComponentLink1Description: Manufacturer Link; ComponentLink1URL: http://www.tycoelectronics.com/; ComponentLink2Description: Packaging Specification; ComponentLink2URL: http://ecommas.tycoelectronics.com/commerce/DocumentDelivery/DDEController?Action=showdoc&DocId=Customer+Drawing%7F1364372%7FD%7Ftif%7FEnglish%7FENG_CD_1364372_D.tif
R19-R21 = Res: Semiconductor Resistor; Published: 8-Jun-2000; LatestRevisionDate: 17-Jul-2002; LatestRevisionNote: Re-released for DXP Platform.; PackageReference: AXIAL-0.5; Publisher: Altium Limited
usart1 = Header 3: Header, 3-Pin; LatestRevisionDate: 17-Jul-2002; LatestRevisionNote: Re-released for DXP Platform.; Publisher: Altium Limited

## Sheet sensor10DOF-S.SchDoc
size A
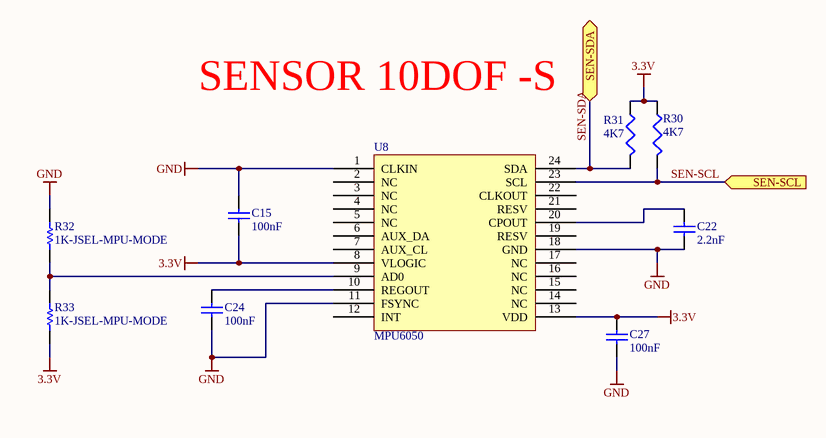
[diagram p8: sensor10DOF-S.SchDoc]

### Parts
C15  100nF  [2012[0805]]
C22  2.2nF  [2012[0805]]
C24  100nF  [2012[0805]]
C27  100nF  [2012[0805]]
R30  4K7  [2012[0805]]
R31  4K7  [2012[0805]]
R32  1K-JSEL-MPU-MODE  [2012[0805]]
R33  1K-JSEL-MPU-MODE  [2012[0805]]
U8  MPU6050  [QFN_36]

### Ports
SEN-SCL (in), SEN-SDA

### Nets
3.3V: C15.1 C27.2 R30.1 R31.1 R33.1 U8.8(VLOGIC) U8.13(VDD)
GND: C15.2 C22.1 C24.1 C27.1 R32.2 U8.1(CLKIN) U8.11(FSYNC) U8.18(GND)  [project net ADD0]
SEN-SCL: R30.2 U8.23(SCL) ; port SEN-SCL  [project net PORTD1]
SEN-SDA: R31.2 U8.24(SDA) ; port SEN-SDA  [project net PORTD0]
NetC22_2: C22.2 U8.20(CPOUT)
NetC24_2: C24.2 U8.10(REGOUT)
NetR32_1: R32.1 R33.2 U8.9(AD0)

Not connected (* = marked no-connect by the designer): U8 2(NC) 3(NC) 4(NC) 5(NC) 6(AUX_DA) 7(AUX_CL) 12(INT) 14(NC) 15(NC) 16(NC) 17(NC) 19(RESV) 21(RESV) 22(CLKOUT)

### Notes on the sheet
- SENSOR 10DOF -S

### Library data of the parts
C15 C24 C27 = Cap: Capacitor; Published: 8-Jun-2000; LatestRevisionDate: 17-Jul-2002; LatestRevisionNote: Re-released for DXP Platform.; PackageReference: RAD-0.3; Publisher: Altium Limited; Value: 100nF
C22 = Cap: Capacitor; Value: 100nF; Published: 8-Jun-2000; LatestRevisionDate: 17-Jul-2002; LatestRevisionNote: Re-released for DXP Platform.; PackageReference: RAD-0.3; Publisher: Altium Limited
R30 R31 = Res3: Resistor; Value: 10K; Published: 8-Jun-2000; LatestRevisionDate: 04-Mar-2005; LatestRevisionNote: PCB Footprint replaced.; PackageReference: J1-0603; Publisher: Altium Limited
R32 R33 = Res1: Resistor; Value: 1K; Published: 8-Jun-2000; LatestRevisionDate: 17-Jul-2002; LatestRevisionNote: Re-released for DXP Platform.; PackageReference: AXIAL-0.3; Publisher: Altium Limited

## Nets that join several sheets
3.3V: Led1 (R25_Led1.2), Led2 (R25_Led2.2), Led3 (R25_Led3.2), IR1 (R23_IR1.1 R34_IR1.1 VR1_IR1.2 VR1_IR1.3), IR2 (R23_IR2.1 R34_IR2.1 VR1_IR2.2 VR1_IR2.3), atxmega128a1 (27 pins), Power (7 pins), Transceiver (U7.2), FT232 (C4.2 R21.2 U4.4 U4.17), sensor10DOF-S (7 pins)
5V: Main Sheet (R14.2 R15.2), atxmega128a1 (LCD1.2), Power (11 pins), Driver Motor1 (*_Driver_Motor1.5 BL1_DriverMotor1.11 encoder1_DriverMotor1.3), Driver Motor2 (*_Driver_Motor2.5 *_Driver_Motor2.7 BL1_DriverMotor2.11 encoder1_DriverMotor2.3), Driver Motor3 (*_Driver_Motor3.5 *_Driver_Motor3.8 BL1_DriverMotor3.11 encoder1_DriverMotor3.3), Driver Motor4 (5 pins), FT232 (6 pins)
ADD0: Led1 (Q3_Led1.3), Led2 (Q3_Led2.3), Led3 (Q3_Led3.3), IR1 (P2_IR1.1 Q2_IR1.3), IR2 (P2_IR2.1 Q2_IR2.3), atxmega128a1 (38 pins), Power (24 pins), Transceiver (U7.1), Driver Motor1 (6 pins), Driver Motor2 (5 pins), Driver Motor3 (5 pins), Driver Motor4 (*_Driver_Motor4.11 *_Driver_Motor4.16 BL1_DriverMotor4.7 encoder1_DriverMotor4.1), FT232 (11 pins), sensor10DOF-S (8 pins)
Battery: Power (kick1.1 S7.2), Driver Motor1 (F1_DriverMotor1.2 R18_DriverMotor1.1), Driver Motor2 (F1_DriverMotor2.2 R18_DriverMotor2.1), Driver Motor3 (F1_DriverMotor3.2 R18_DriverMotor3.1), Driver Motor4 (F1_DriverMotor4.2 R18_DriverMotor4.1)
CE: atxmega128a1 (U3.36), Transceiver (U7.3)
CSN: atxmega128a1 (U3.39), Transceiver (U7.4)
DISCHARGE: Main Sheet (madarshoot1.4), atxmega128a1 (U3.11)
IR1: IR1 (Q2_IR1.1 R23_IR1.2), atxmega128a1 (U3.31)
IR2: IR2 (Q2_IR2.1 R23_IR2.2), atxmega128a1 (U3.32)
IRQ: atxmega128a1 (U3.35), Transceiver (U7.8)
KICKD0: Main Sheet (madarshoot1.2), atxmega128a1 (U3.16)
KICKD1: Main Sheet (madarshoot1.3), atxmega128a1 (U3.15)
LED1: Led1 (R24_Led1.1), atxmega128a1 (U3.27)
LED2: Led2 (R24_Led2.1), atxmega128a1 (U3.28)
LED3: Led3 (R24_Led3.1), atxmega128a1 (U3.30)
MISO: atxmega128a1 (U3.41), Transceiver (U7.7)
MOSI: atxmega128a1 (U3.40), Transceiver (U7.6)
PORTA2: atxmega128a1 (U3.97), Power (C9.1 R29.2 R35.2 S8.1)
PORTA3: atxmega128a1 (U3.98), Power (R27.1 R28.2)
PORTB7: Main Sheet (madarshoot1.1), atxmega128a1 (U3.12)
PORTD0: atxmega128a1 (U3.25), sensor10DOF-S (R31.2 U8.24)
PORTD1: atxmega128a1 (U3.26), sensor10DOF-S (R30.2 U8.23)
PORTE2: atxmega128a1 (U3.37), FT232 (U4.1 usart1.3)
PORTE3: atxmega128a1 (U3.38), FT232 (U4.5 usart1.2)
PORTE7: atxmega128a1 (U3.42), Transceiver (U7.5)
PORTF0: Main Sheet (R15.1), atxmega128a1 (U3.45)
PORTF1: Main Sheet (R14.1), atxmega128a1 (U3.46)
PORTF2: Main Sheet (Q5.1), atxmega128a1 (R17.2 U3.47)
PORTF3: atxmega128a1 (U3.48), Driver Motor1 (*_Driver_Motor1.2), Driver Motor2 (*_Driver_Motor2.2), Driver Motor3 (*_Driver_Motor3.2), Driver Motor4 (*_Driver_Motor4.2)
PORTF6: Main Sheet (Q4.1), atxmega128a1 (R36.2 U3.51)
TX_Driver: Main Sheet (Q4.2), Driver Motor2 (R37_DriverMotor2.2)
TX_Driver: Main Sheet (Q4.3), Driver Motor1 (R37_DriverMotor1.2)
TX_Driver: Main Sheet (Q5.2), Driver Motor4 (R37_DriverMotor4.2)
TX_Driver: Main Sheet (Q5.3), Driver Motor3 (R37_DriverMotor3.2)